# Altium schematic sheet FPGA.SchDoc: Power and decoupling FPGA
size C; DocumentNumber: 4; SheetNumber: 4
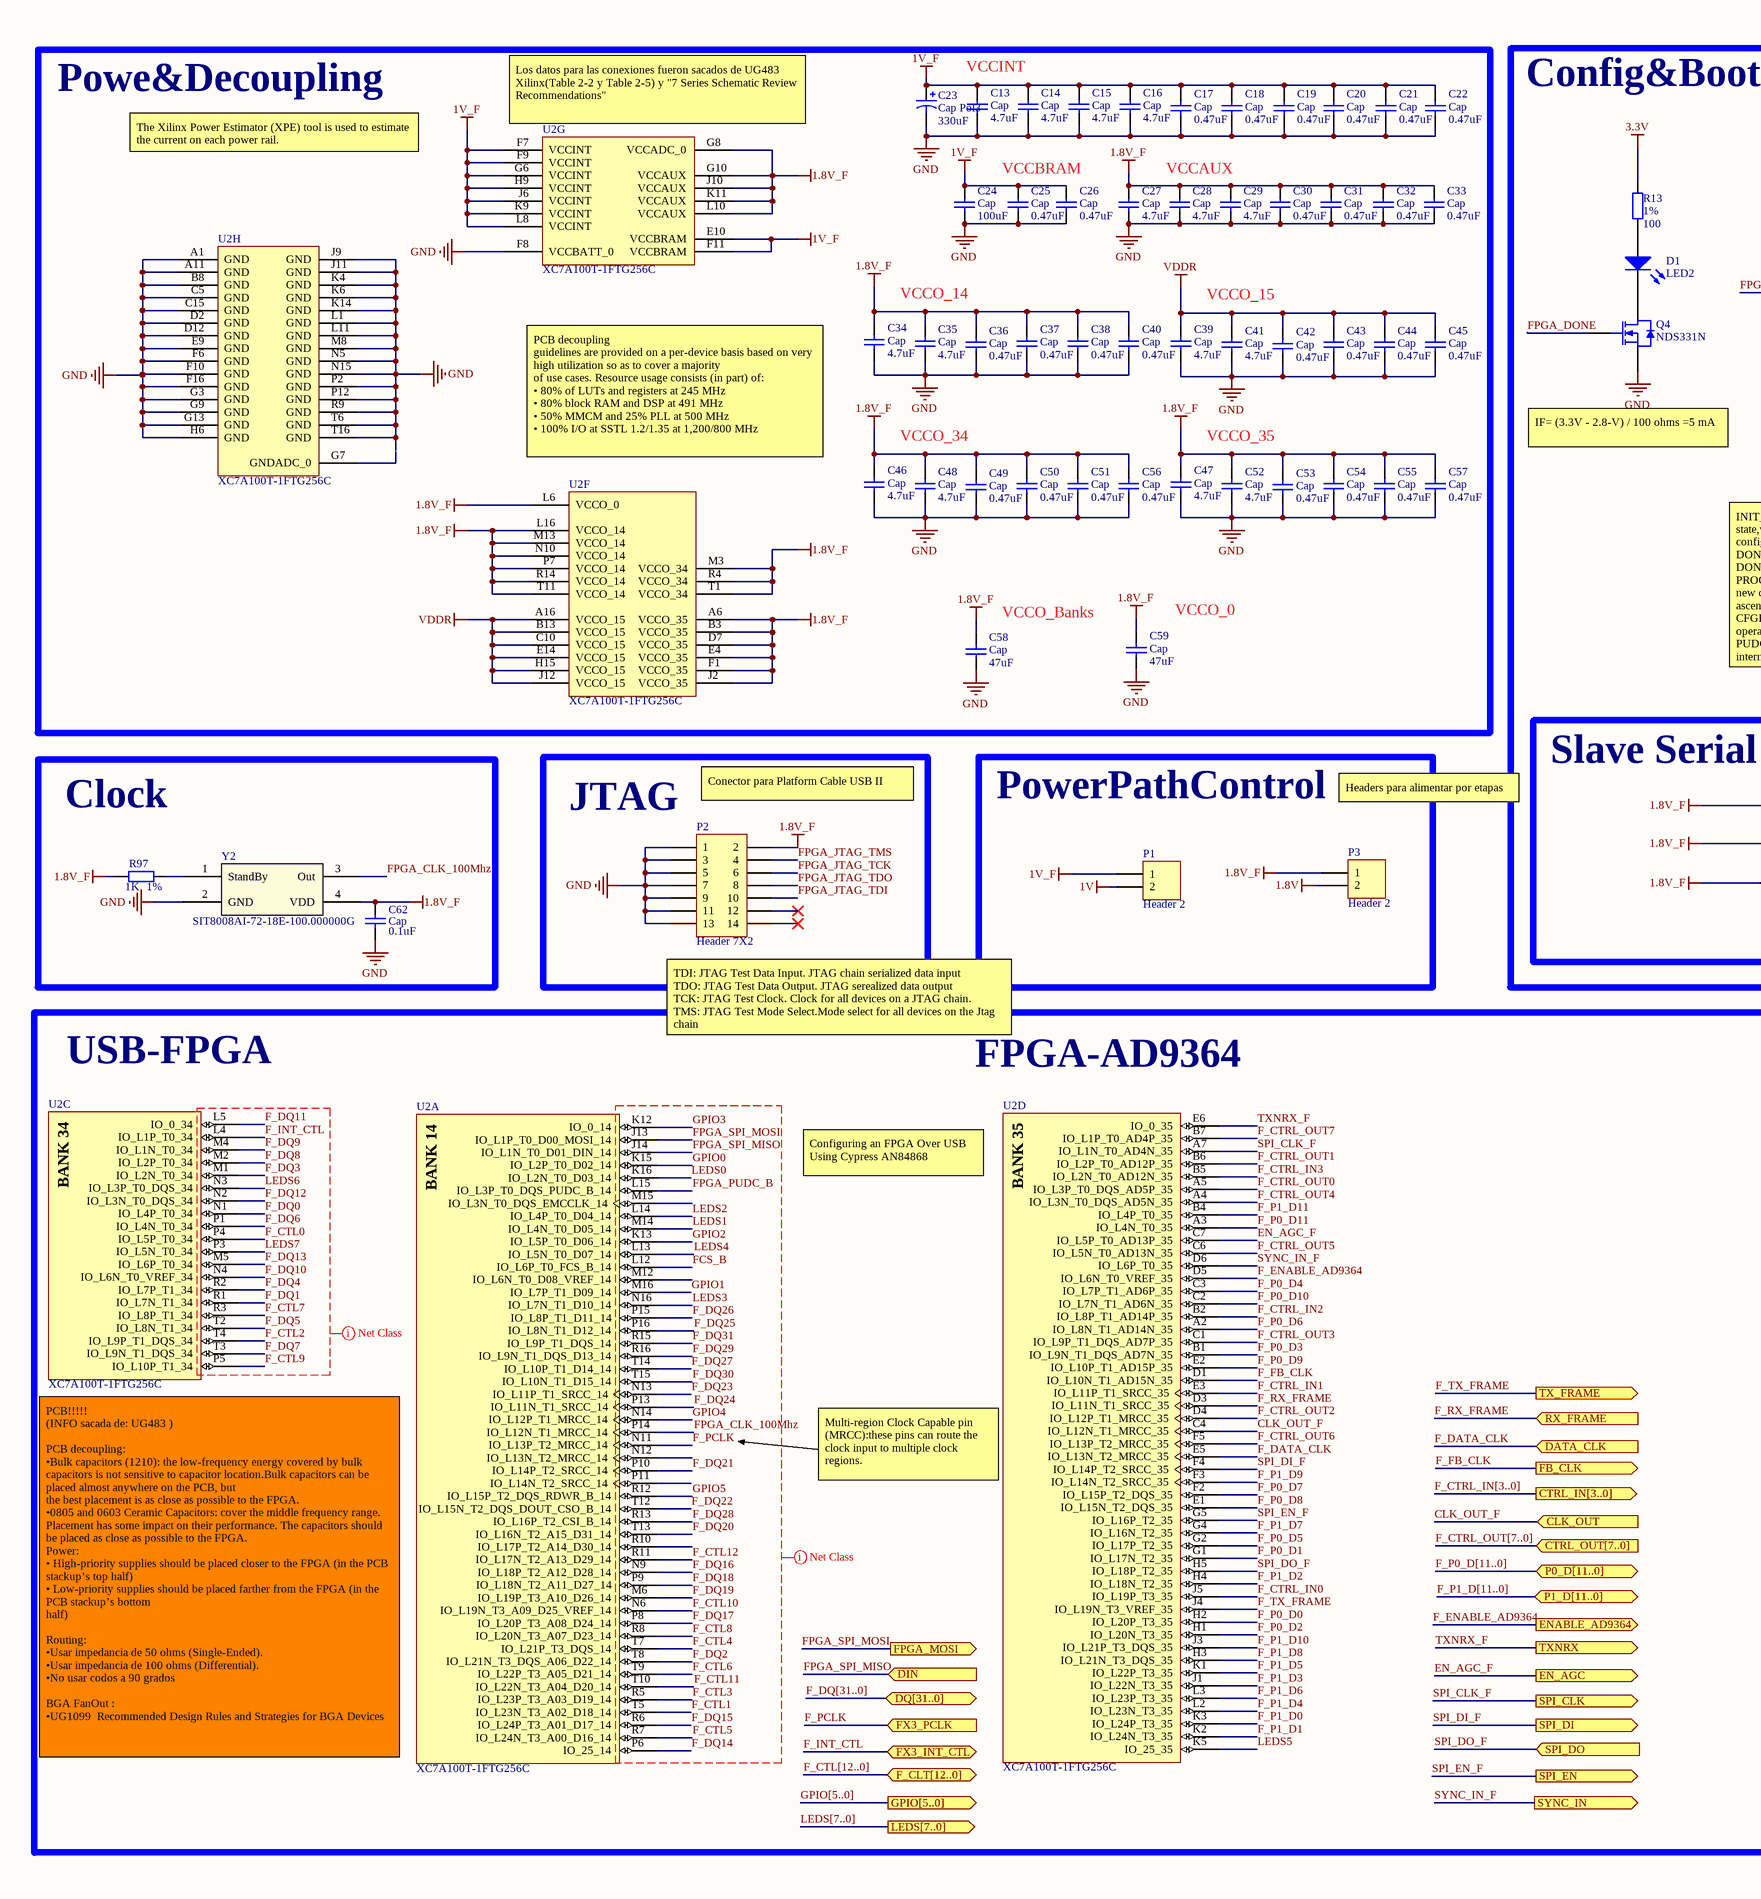
[diagram p0: FPGA.SchDoc, left]
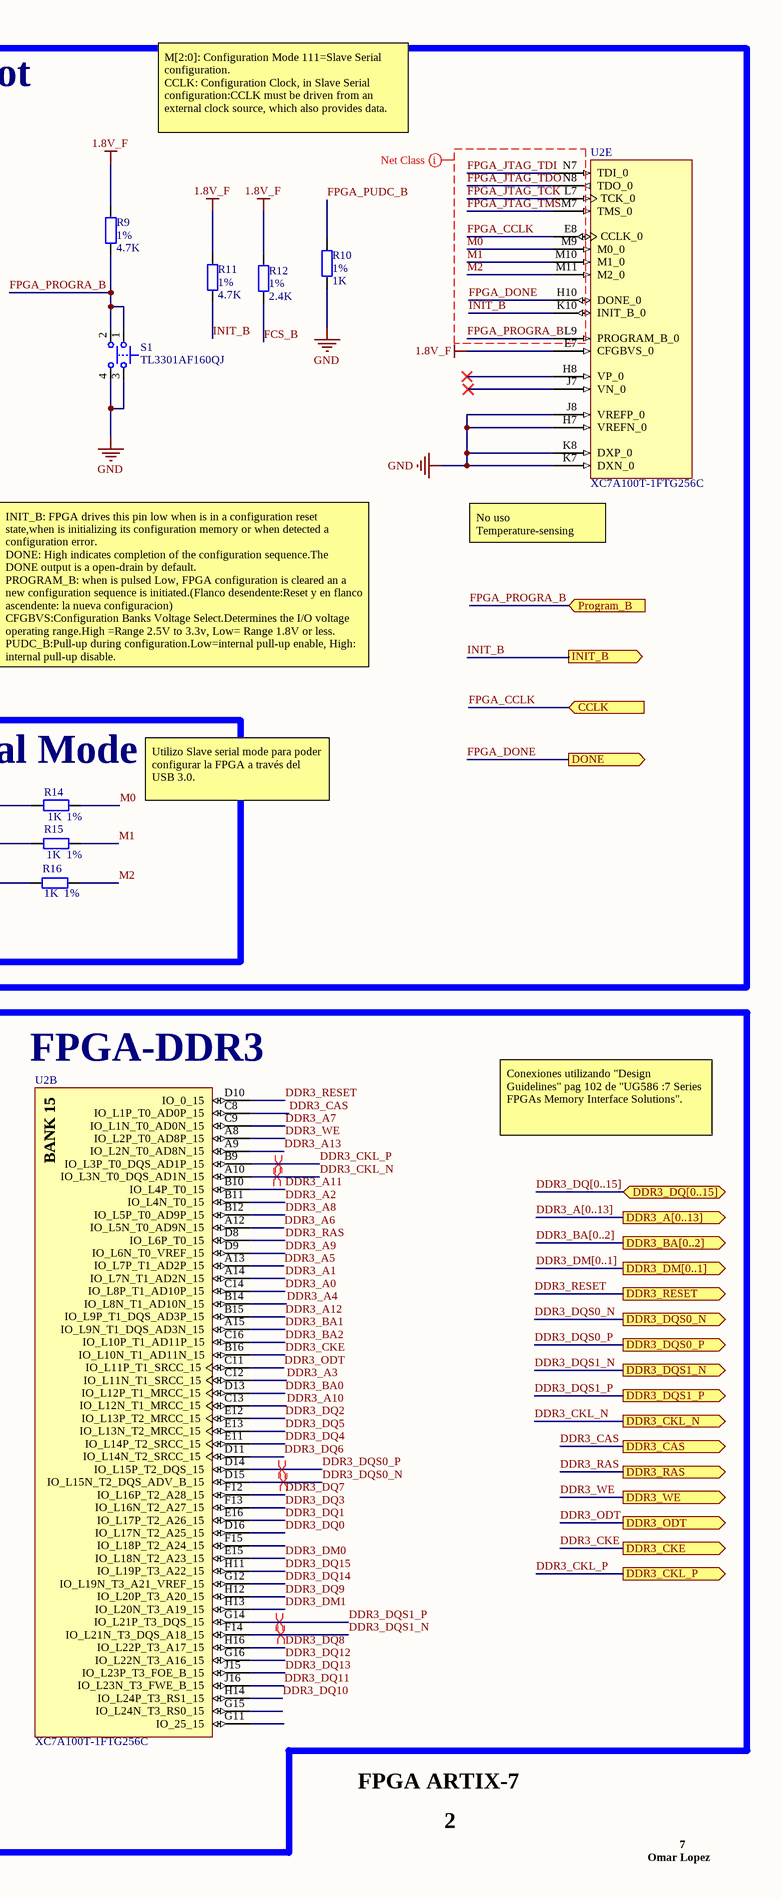
[diagram p1: FPGA.SchDoc, right]

## Parts
C13  Cap  value 4.7uF  [GRM0805MurataCap]
C14  Cap  value 4.7uF  [GRM0805MurataCap]
C15  Cap  value 4.7uF  [GRM0805MurataCap]
C16  Cap  value 4.7uF  [GRM0805MurataCap]
C17  Cap  value 0.47uF  [GRM0603MurataCap]
C18  Cap  value 0.47uF  [GRM0603MurataCap]
C19  Cap  value 0.47uF  [GRM0603MurataCap]
C20  Cap  value 0.47uF  [GRM0603MurataCap]
C21  Cap  value 0.47uF  [GRM0603MurataCap]
C22  Cap  value 0.47uF  [GRM0603MurataCap]
C23  Cap Pol3  value 330uF  [7343]
C24  Cap  value 100uF  [GRM1210MurataCap]
C25  Cap  value 0.47uF  [GRM0603MurataCap]
C26  Cap  value 0.47uF  [GRM0603MurataCap]
C27  Cap  value 4.7uF  [GRM0805MurataCap]
C28  Cap  value 4.7uF  [GRM0805MurataCap]
C29  Cap  value 4.7uF  [GRM0805MurataCap]
C30  Cap  value 0.47uF  [GRM0603MurataCap]
C31  Cap  value 0.47uF  [GRM0603MurataCap]
C32  Cap  value 0.47uF  [GRM0603MurataCap]
C33  Cap  value 0.47uF  [GRM0603MurataCap]
C34  Cap  value 4.7uF  [GRM0805MurataCap]
C35  Cap  value 4.7uF  [GRM0805MurataCap]
C36  Cap  value 0.47uF  [GRM0603MurataCap]
C37  Cap  value 0.47uF  [GRM0603MurataCap]
C38  Cap  value 0.47uF  [GRM0603MurataCap]
C39  Cap  value 4.7uF  [GRM0805MurataCap]
C40  Cap  value 0.47uF  [GRM0603MurataCap]
C41  Cap  value 4.7uF  [GRM0805MurataCap]
C42  Cap  value 0.47uF  [GRM0603MurataCap]
C43  Cap  value 0.47uF  [GRM0603MurataCap]
C44  Cap  value 0.47uF  [GRM0603MurataCap]
C45  Cap  value 0.47uF  [GRM0603MurataCap]
C46  Cap  value 4.7uF  [GRM0805MurataCap]
C47  Cap  value 4.7uF  [GRM0805MurataCap]
C48  Cap  value 4.7uF  [GRM0805MurataCap]
C49  Cap  value 0.47uF  [GRM0603MurataCap]
C50  Cap  value 0.47uF  [GRM0603MurataCap]
C51  Cap  value 0.47uF  [GRM0603MurataCap]
C52  Cap  value 4.7uF  [GRM0805MurataCap]
C53  Cap  value 0.47uF  [GRM0603MurataCap]
C54  Cap  value 0.47uF  [GRM0603MurataCap]
C55  Cap  value 0.47uF  [GRM0603MurataCap]
C56  Cap  value 0.47uF  [GRM0603MurataCap]
C57  Cap  value 0.47uF  [GRM0603MurataCap]
C58  Cap  value 47uF  [GRM1210MurataCap]
C59  Cap  value 47uF  [GRM1210MurataCap]
C62  Cap  value 0.1uF  [GRM0402MurataCap]
D1  LED2  [LTSTC191]
P1  Header 2  [Header2x1]
P2  Header 7X2  [MolexHeader2x7_]
P3  Header 2  [Header2x1]
Q4  NDS331N  [ON_Semi_527AG-01_0]
R9  1%  value 4.7K  [RC0402N]
R10  1%  value 1K  [RC0402N]
R11  1%  value 4.7K  [RC0402N]
R12  1%  value 2.4K  [RC0402N]
R13  1%  value 100  [RC0402N]
R14  1%  value 1K  [RC0402N]
R15  1%  value 1K  [RC0402N]
R16  1%  value 1K  [RC0402N]
R97  1%  value 1K  [RC0402N]
S1  TL3301AF160QJ  [TL3301AF160QJ]
U2  XC7A100T-1FTG256C  [FTG256]  (parts A,B,C,D,E,F,G,H of 8)
Y2  SIT8008AI-72-18E-100.000000G  [SiT2002AI-72-18E-100.000000G]

## Blocks framed on the sheet
Powe&Decoupling: C13-C59 U2
Config&Boot: D1 Q4 R9-R13 S1 U2
JTAG: P2
PowerPathControl: P1 P3
Slave Serial Mode: R14-R16
Clock: C62 R97 Y2

## Ports
CCLK (in), CLK_OUT (in), CTRL_IN[3..0] (out), CTRL_OUT[7..0] (in), DATA_CLK (in), DDR3_A[0..13] (out), DDR3_BA[0..2] (out), DDR3_CAS (out), DDR3_CKE (out), DDR3_CKL_N (out), DDR3_CKL_P (out), DDR3_DM[0..1] (out), DDR3_DQ[0..15] (bidir), DDR3_DQS0_N (out), DDR3_DQS0_P (out), DDR3_DQS1_N (out), DDR3_DQS1_P (out), DDR3_ODT (out), DDR3_RAS (out), DDR3_RESET (out), DDR3_WE (out), DIN (in), DONE (out), DQ[31..0] (bidir), EN_AGC (out), ENABLE_AD9364 (out), F_CLT[12..0] (bidir), FB_CLK (out), FPGA_MOSI (out), FX3_INT_CTL (bidir), FX3_PCLK (in), GPIO[5..0] (out), INIT_B (out), LEDS[7..0] (out), P0_D[11..0] (bidir), P1_D[11..0] (bidir), Program_B (in), RX_FRAME (in), SPI_CLK (out), SPI_DI (out), SPI_DO (in), SPI_EN (out), SYNC_IN (out), TX_FRAME (out), TXNRX (out)

## Nets
1.8V: P3.2
1.8V_F: C27.1 C28.1 C29.1 C30.1 C31.1 C32.1 C33.1 C34.1 C35.1 C36.1 C37.1 C38.1 C40.1 C46.1 C47.1 C48.1 C49.1 C50.1 C51.1 C52.1 C53.1 C54.1 C55.1 C56.1 C57.1 C58.1 C59.1 C62.1 P2.2 P3.1 R9.2 R11.2 R12.2 R14.2 R15.2 R16.2 R97.1 U2.A6(VCCO_35) U2.B3(VCCO_35) U2.D7(VCCO_35) U2.E4(VCCO_35) U2.E7(CFGBVS_0) U2.F1(VCCO_35) U2.G8(VCCADC_0) U2.G10(VCCAUX) U2.J2(VCCO_35) U2.J10(VCCAUX) U2.K11(VCCAUX) U2.L6(VCCO_0) U2.L10(VCCAUX) U2.L16(VCCO_14) U2.M3(VCCO_34) U2.M13(VCCO_14) U2.N10(VCCO_14) U2.P7(VCCO_14) U2.R4(VCCO_34) U2.R14(VCCO_14) U2.T1(VCCO_34) U2.T11(VCCO_14) Y2.4(VDD)
1V: P1.2
1V_F: C13.1 C14.1 C15.1 C16.1 C17.1 C18.1 C19.1 C20.1 C21.1 C22.1 C23.1 C24.1 C25.1 C26.1 P1.1 U2.E10(VCCBRAM) U2.F7(VCCINT) U2.F9(VCCINT) U2.F11(VCCBRAM) U2.G6(VCCINT) U2.H9(VCCINT) U2.J6(VCCINT) U2.K9(VCCINT) U2.L8(VCCINT)
3.3V: R13.2
GND: C13.2 C14.2 C15.2 C16.2 C17.2 C18.2 C19.2 C20.2 C21.2 C22.2 C23.2 C24.2 C25.2 C26.2 C27.2 C28.2 C29.2 C30.2 C31.2 C32.2 C33.2 C34.2 C35.2 C36.2 C37.2 C38.2 C39.2 C40.2 C41.2 C42.2 C43.2 C44.2 C45.2 C46.2 C47.2 C48.2 C49.2 C50.2 C51.2 C52.2 C53.2 C54.2 C55.2 C56.2 C57.2 C58.2 C59.2 C62.2 P2.1 P2.3 P2.5 P2.7 P2.9 P2.11 P2.13 Q4.3(S) R10.2 S1.3 S1.4 U2.A1(GND) U2.A11(GND) U2.B8(GND) U2.C5(GND) U2.C15(GND) U2.D2(GND) U2.D12(GND) U2.E9(GND) U2.F6(GND) U2.F8(VCCBATT_0) U2.F10(GND) U2.F16(GND) U2.G3(GND) U2.G9(GND) U2.G13(GND) U2.H6(GND) U2.H7(VREFN_0) U2.J8(VREFP_0) U2.J9(GND) U2.J11(GND) U2.K4(GND) U2.K6(GND) U2.K7(DXN_0) U2.K8(DXP_0) U2.K14(GND) U2.L1(GND) U2.L11(GND) U2.M8(GND) U2.N5(GND) U2.N15(GND) U2.P2(GND) U2.P12(GND) U2.R9(GND) U2.T6(GND) U2.T16(GND) Y2.2(GND)
VDDR: C39.1 C41.1 C42.1 C43.1 C44.1 C45.1 U2.A16(VCCO_15) U2.B13(VCCO_15) U2.C10(VCCO_15) U2.E14(VCCO_15) U2.H15(VCCO_15) U2.J12(VCCO_15)
CLK_OUT_F: U2.C4(IO_L12N_T1_MRCC_35) ; port CLK_OUT
DDR3_A0: U2.C14(IO_L8P_T1_AD10P_15)
DDR3_A1: U2.A14(IO_L7N_T1_AD2N_15)
DDR3_A2: U2.B11(IO_L4N_T0_15)
DDR3_A3: U2.C12(IO_L11N_T1_SRCC_15)
DDR3_A4: U2.B14(IO_L8N_T1_AD10N_15)
DDR3_A5: U2.A13(IO_L7P_T1_AD2P_15)
DDR3_A6: U2.A12(IO_L5N_T0_AD9N_15)
DDR3_A7: U2.C9(IO_L1N_T0_AD0N_15)
DDR3_A8: U2.B12(IO_L5P_T0_AD9P_15)
DDR3_A9: U2.D9(IO_L6N_T0_VREF_15)
DDR3_A10: U2.C13(IO_L12N_T1_MRCC_15)
DDR3_A11: U2.B10(IO_L4P_T0_15)
DDR3_A12: U2.B15(IO_L9P_T1_DQS_AD3P_15)
DDR3_A13: U2.A9(IO_L2N_T0_AD8N_15)
DDR3_BA0: U2.D13(IO_L12P_T1_MRCC_15)
DDR3_BA1: U2.A15(IO_L9N_T1_DQS_AD3N_15)
DDR3_BA2: U2.C16(IO_L10P_T1_AD11P_15)
DDR3_CAS: U2.C8(IO_L1P_T0_AD0P_15) ; port DDR3_CAS
DDR3_CKE: U2.B16(IO_L10N_T1_AD11N_15) ; port DDR3_CKE
DDR3_CKL_N: U2.A10(IO_L3N_T0_DQS_AD1N_15) ; port DDR3_CKL_N
DDR3_CKL_P: U2.B9(IO_L3P_T0_DQS_AD1P_15) ; port DDR3_CKL_P
DDR3_DM0: U2.E15(IO_L18N_T2_A23_15)
DDR3_DM1: U2.H13(IO_L20N_T3_A19_15)
DDR3_DQ0: U2.D16(IO_L17N_T2_A25_15)
DDR3_DQ1: U2.E16(IO_L17P_T2_A26_15)
DDR3_DQ2: U2.E12(IO_L13P_T2_MRCC_15)
DDR3_DQ3: U2.F13(IO_L16N_T2_A27_15)
DDR3_DQ4: U2.E11(IO_L14P_T2_SRCC_15)
DDR3_DQ5: U2.E13(IO_L13N_T2_MRCC_15)
DDR3_DQ6: U2.D11(IO_L14N_T2_SRCC_15)
DDR3_DQ7: U2.F12(IO_L16P_T2_A28_15)
DDR3_DQ8: U2.H16(IO_L22P_T3_A17_15)
DDR3_DQ9: U2.H12(IO_L20P_T3_A20_15)
DDR3_DQ10: U2.H14(IO_L24P_T3_RS1_15)
DDR3_DQ11: U2.J16(IO_L23N_T3_FWE_B_15)
DDR3_DQ12: U2.G16(IO_L22N_T3_A16_15)
DDR3_DQ13: U2.J15(IO_L23P_T3_FOE_B_15)
DDR3_DQ14: U2.G12(IO_L19N_T3_A21_VREF_15)
DDR3_DQ15: U2.H11(IO_L19P_T3_A22_15)
DDR3_DQS0_N: U2.D15(IO_L15N_T2_DQS_ADV_B_15) ; port DDR3_DQS0_N
DDR3_DQS0_P: U2.D14(IO_L15P_T2_DQS_15) ; port DDR3_DQS0_P
DDR3_DQS1_N: U2.F14(IO_L21N_T3_DQS_A18_15) ; port DDR3_DQS1_N
DDR3_DQS1_P: U2.G14(IO_L21P_T3_DQS_15) ; port DDR3_DQS1_P
DDR3_ODT: U2.C11(IO_L11P_T1_SRCC_15) ; port DDR3_ODT
DDR3_RAS: U2.D8(IO_L6P_T0_15) ; port DDR3_RAS
DDR3_RESET: U2.D10(IO_0_15) ; port DDR3_RESET
DDR3_WE: U2.A8(IO_L2P_T0_AD8P_15) ; port DDR3_WE
EN_AGC_F: U2.C7(IO_L5P_T0_AD13P_35) ; port EN_AGC
F_CTL0: U2.P4(IO_L5P_T0_34)
F_CTL1: U2.T5(IO_L23N_T3_A02_D18_14)
F_CTL2: U2.T4(IO_L9P_T1_DQS_34)
F_CTL3: U2.R5(IO_L23P_T3_A03_D19_14)
F_CTL4: U2.T7(IO_L21P_T3_DQS_14)
F_CTL5: U2.R7(IO_L24N_T3_A00_D16_14)
F_CTL6: U2.T9(IO_L22P_T3_A05_D21_14)
F_CTL7: U2.R3(IO_L8P_T1_34)
F_CTL8: U2.R8(IO_L20N_T3_A07_D23_14)
F_CTL9: U2.P5(IO_L10P_T1_34)
F_CTL10: U2.N6(IO_L19N_T3_A09_D25_VREF_14)
F_CTL11: U2.T10(IO_L22N_T3_A04_D20_14)
F_CTL12: U2.R11(IO_L17N_T2_A13_D29_14)
F_CTRL_IN0: U2.J5(IO_L19P_T3_35)
F_CTRL_IN1: U2.E3(IO_L11P_T1_SRCC_35)
F_CTRL_IN2: U2.B2(IO_L8P_T1_AD14P_35)
F_CTRL_IN3: U2.B5(IO_L2N_T0_AD12N_35)
F_CTRL_OUT0: U2.A5(IO_L3P_T0_DQS_AD5P_35)
F_CTRL_OUT1: U2.B6(IO_L2P_T0_AD12P_35)
F_CTRL_OUT2: U2.D4(IO_L12P_T1_MRCC_35)
F_CTRL_OUT3: U2.C1(IO_L9P_T1_DQS_AD7P_35)
F_CTRL_OUT4: U2.A4(IO_L3N_T0_DQS_AD5N_35)
F_CTRL_OUT5: U2.C6(IO_L5N_T0_AD13N_35)
F_CTRL_OUT6: U2.F5(IO_L13P_T2_MRCC_35)
F_CTRL_OUT7: U2.B7(IO_L1P_T0_AD4P_35)
F_DATA_CLK: U2.E5(IO_L13N_T2_MRCC_35) ; port DATA_CLK
F_DQ0: U2.N1(IO_L4P_T0_34)
F_DQ1: U2.R1(IO_L7N_T1_34)
F_DQ2: U2.T8(IO_L21N_T3_DQS_A06_D22_14)
F_DQ3: U2.M1(IO_L2N_T0_34)
F_DQ4: U2.R2(IO_L7P_T1_34)
F_DQ5: U2.T2(IO_L8N_T1_34)
F_DQ6: U2.P1(IO_L4N_T0_34)
F_DQ7: U2.T3(IO_L9N_T1_DQS_34)
F_DQ8: U2.M2(IO_L2P_T0_34)
F_DQ9: U2.M4(IO_L1N_T0_34)
F_DQ10: U2.N4(IO_L6N_T0_VREF_34)
F_DQ11: U2.L5(IO_0_34)
F_DQ12: U2.N2(IO_L3N_T0_DQS_34)
F_DQ13: U2.M5(IO_L6P_T0_34)
F_DQ14: U2.P6(IO_25_14)
F_DQ15: U2.R6(IO_L24P_T3_A01_D17_14)
F_DQ16: U2.N9(IO_L18P_T2_A12_D28_14)
F_DQ17: U2.P8(IO_L20P_T3_A08_D24_14)
F_DQ18: U2.P9(IO_L18N_T2_A11_D27_14)
F_DQ19: U2.M6(IO_L19P_T3_A10_D26_14)
F_DQ20: U2.T13(IO_L16N_T2_A15_D31_14)
F_DQ21: U2.P10(IO_L14P_T2_SRCC_14)
F_DQ22: U2.T12(IO_L15N_T2_DQS_DOUT_CSO_B_14)
F_DQ23: U2.N13(IO_L11P_T1_SRCC_14)
F_DQ24: U2.P13(IO_L11N_T1_SRCC_14)
F_DQ25: U2.P16(IO_L8N_T1_D12_14)
F_DQ26: U2.P15(IO_L8P_T1_D11_14)
F_DQ27: U2.T14(IO_L10P_T1_D14_14)
F_DQ28: U2.R13(IO_L16P_T2_CSI_B_14)
F_DQ29: U2.R16(IO_L9N_T1_DQS_D13_14)
F_DQ30: U2.T15(IO_L10N_T1_D15_14)
F_DQ31: U2.R15(IO_L9P_T1_DQS_14)
F_ENABLE_AD9364: U2.D5(IO_L6N_T0_VREF_35) ; port ENABLE_AD9364
F_FB_CLK: U2.D1(IO_L10N_T1_AD15N_35) ; port FB_CLK
F_INT_CTL: U2.L4(IO_L1P_T0_34) ; port FX3_INT_CTL
F_P0_D0: U2.H2(IO_L20P_T3_35)
F_P0_D1: U2.G1(IO_L17N_T2_35)
F_P0_D2: U2.H1(IO_L20N_T3_35)
F_P0_D3: U2.B1(IO_L9N_T1_DQS_AD7N_35)
F_P0_D4: U2.C3(IO_L7P_T1_AD6P_35)
F_P0_D5: U2.G2(IO_L17P_T2_35)
F_P0_D6: U2.A2(IO_L8N_T1_AD14N_35)
F_P0_D7: U2.F2(IO_L15P_T2_DQS_35)
F_P0_D8: U2.E1(IO_L15N_T2_DQS_35)
F_P0_D9: U2.E2(IO_L10P_T1_AD15P_35)
F_P0_D10: U2.C2(IO_L7N_T1_AD6N_35)
F_P0_D11: U2.A3(IO_L4N_T0_35)
F_P1_D0: U2.K3(IO_L24P_T3_35)
F_P1_D1: U2.K2(IO_L24N_T3_35)
F_P1_D2: U2.H4(IO_L18N_T2_35)
F_P1_D3: U2.J1(IO_L22N_T3_35)
F_P1_D4: U2.L2(IO_L23N_T3_35)
F_P1_D5: U2.K1(IO_L22P_T3_35)
F_P1_D6: U2.L3(IO_L23P_T3_35)
F_P1_D7: U2.G4(IO_L16N_T2_35)
F_P1_D8: U2.H3(IO_L21N_T3_DQS_35)
F_P1_D9: U2.F3(IO_L14N_T2_SRCC_35)
F_P1_D10: U2.J3(IO_L21P_T3_DQS_35)
F_P1_D11: U2.B4(IO_L4P_T0_35)
F_PCLK: U2.N11(IO_L13P_T2_MRCC_14) ; port FX3_PCLK
F_RX_FRAME: U2.D3(IO_L11N_T1_SRCC_35) ; port RX_FRAME
F_TX_FRAME: U2.J4(IO_L19N_T3_VREF_35) ; port TX_FRAME
FCS_B: R12.1 U2.L12(IO_L6P_T0_FCS_B_14)
FPGA_CCLK: U2.E8(CCLK_0) ; port CCLK
FPGA_CLK_100Mhz: U2.P14(IO_L12N_T1_MRCC_14) Y2.3(Out)
FPGA_DONE: Q4.1(G) U2.H10(DONE_0) ; port DONE
FPGA_JTAG_TCK: P2.6 U2.L7(TCK_0)
FPGA_JTAG_TDI: P2.10 U2.N7(TDI_0)
FPGA_JTAG_TDO: P2.8 U2.N8(TDO_0)
FPGA_JTAG_TMS: P2.4 U2.M7(TMS_0)
FPGA_PROGRA_B: R9.1 S1.1 S1.2 U2.L9(PROGRAM_B_0) ; port Program_B
FPGA_PUDC_B: R10.1 U2.L15(IO_L3P_T0_DQS_PUDC_B_14)
FPGA_SPI_MISO: U2.J14(IO_L1N_T0_D01_DIN_14) ; port DIN
FPGA_SPI_MOSI: U2.J13(IO_L1P_T0_D00_MOSI_14) ; port FPGA_MOSI
GPIO0: U2.K15(IO_L2P_T0_D02_14)
GPIO1: U2.M16(IO_L7P_T1_D09_14)
GPIO2: U2.K13(IO_L5P_T0_D06_14)
GPIO3: U2.K12(IO_0_14)
GPIO4: U2.N14(IO_L12P_T1_MRCC_14)
GPIO5: U2.R12(IO_L15P_T2_DQS_RDWR_B_14)
INIT_B: R11.1 U2.K10(INIT_B_0) ; port INIT_B
LEDS0: U2.K16(IO_L2N_T0_D03_14)
LEDS1: U2.M14(IO_L4N_T0_D05_14)
LEDS2: U2.L14(IO_L4P_T0_D04_14)
LEDS3: U2.N16(IO_L7N_T1_D10_14)
LEDS4: U2.L13(IO_L5N_T0_D07_14)
LEDS5: U2.K5(IO_25_35)
LEDS6: U2.N3(IO_L3P_T0_DQS_34)
LEDS7: U2.P3(IO_L5N_T0_34)
M0: R14.1 U2.M9(M0_0)
M1: R15.1 U2.M10(M1_0)
M2: R16.1 U2.M11(M2_0)
SPI_CLK_F: U2.A7(IO_L1N_T0_AD4N_35) ; port SPI_CLK
SPI_DI_F: U2.F4(IO_L14P_T2_SRCC_35) ; port SPI_DI
SPI_DO_F: U2.H5(IO_L18P_T2_35) ; port SPI_DO
SPI_EN_F: U2.G5(IO_L16P_T2_35) ; port SPI_EN
SYNC_IN_F: U2.D6(IO_L6P_T0_35) ; port SYNC_IN
TXNRX_F: U2.E6(IO_0_35) ; port TXNRX
NetD1_1: D1.1(A) R13.1
NetD1_2: D1.2(K) Q4.2(D)
NetR97_2: R97.2 Y2.1(StandBy)

Not connected (* = marked no-connect by the designer): P2 12* 14*; U2 F15(IO_L18P_T2_A24_15) G7(GNDADC_0) G11(IO_25_15) G15(IO_L24N_T3_RS0_15) H8(VP_0)* J7(VN_0)* M12(IO_L6N_T0_D08_VREF_14) M15(IO_L3N_T0_DQS_EMCCLK_14) N12(IO_L13N_T2_MRCC_14) P11(IO_L14N_T2_SRCC_14) R10(IO_L17P_T2_A14_D30_14)

## Buses and harness runs
bus DDR3_A[0..13] = port DDR3_A[0..13]
bus DDR3_BA[0..2] = port DDR3_BA[0..2]
bus DDR3_DM[0..1] = port DDR3_DM[0..1]
bus DDR3_DQ[0..15] = port DDR3_DQ[0..15]
bus F_CTL[12..0] = port F_CLT[12..0]
bus F_CTRL_IN[3..0] = port CTRL_IN[3..0]
bus F_CTRL_OUT[7..0] = port CTRL_OUT[7..0]
bus F_DQ[31..0] = port DQ[31..0]
bus F_P0_D[11..0] = port P0_D[11..0]
bus F_P1_D[11..0] = port P1_D[11..0]
bus GPIO[5..0] = port GPIO[5..0]
bus LEDS[7..0] = port LEDS[7..0]

## Layout directives
differential pair; net class DDR3_Diff100: DDR3_CKL_N, DDR3_CKL_P, DDR3_DQS0_N, DDR3_DQS0_P, DDR3_DQS1_N, DDR3_DQS1_P
net class FPGA_Signals: F_CTL0, F_CTL1, F_CTL2, F_CTL3, F_CTL4, F_CTL5, F_CTL6, F_CTL7, F_CTL8, F_CTL9, F_CTL10, F_CTL11, F_CTL12, F_DQ0, F_DQ1, F_DQ2, F_DQ3, F_DQ4, F_DQ5, F_DQ6, F_DQ7, F_DQ8, F_DQ9, F_DQ10, F_DQ11, F_DQ12, F_DQ13, F_DQ14, F_DQ15, F_DQ16, F_DQ17, F_DQ18, F_DQ19, F_DQ20, F_DQ21, F_DQ22, F_DQ23, F_DQ24, F_DQ25, F_DQ26, F_DQ27, F_DQ28, F_DQ29, F_DQ30, F_DQ31, F_INT_CTL, F_PCLK, FCS_B, FPGA_CCLK, FPGA_CLK_100Mhz, FPGA_DONE, FPGA_JTAG_TCK, FPGA_JTAG_TDI, FPGA_JTAG_TDO, FPGA_JTAG_TMS, FPGA_PROGRA_B, FPGA_PUDC_B, FPGA_SPI_MISO, FPGA_SPI_MOSI, GPIO0, GPIO1, GPIO2, GPIO3, GPIO4, GPIO5, INIT_B, LEDS0, LEDS1, LEDS2, LEDS3, LEDS4, LEDS6, LEDS7, M0, M1, M2

## Notes on the sheet
- VCCINT
- The Xilinx Power Estimator (XPE) tool is used to estimate the current on each power rail.
- (near U2) Los datos para las conexiones fueron sacados de UG483 Xilinx(Table 2-2 y Table 2-5) y "7 Series Schematic Review Recommendations"
- M[2:0]: Configuration Mode 111=Slave Serial configuration.
  CCLK: Configuration Clock, in Slave Serial configuration:CCLK must be driven from an external clock source, which also provides data.
- VCCBRAM
- VCCAUX
- VCCO_14
- VCCO_15
- PCB decoupling
  guidelines are provided on a per-device basis based on very high utilization so as to cover a majority
  of use cases. Resource usage consists (in part) of:
  • 80% of LUTs and registers at 245 MHz
  • 80% block RAM and DSP at 491 MHz
  • 50% MMCM and 25% PLL at 500 MHz
  • 100% I/O at SSTL 1.2/1.35 at 1,200/800 MHz
- VCCO_34
- VCCO_35
- IF= (3.3V - 2.8-V) / 100 ohms =5 mA
- (near U2) No uso Temperature-sensing diode(Pag. 27 UG475)
- VCCO_Banks
- (near C59) VCCO_0
- INIT_B: FPGA drives this pin low when is in a configuration reset state,when is initializing its configuration memory or when detected a configuration error.
  DONE: High indicates completion of the configuration sequence.The DONE output is a open-drain by default.
  PROGRAM_B: when is pulsed Low, FPGA configuration is cleared an a new configuration sequence is initiated.(Flanco desendente:Reset y en flanco ascendente: la nueva configuracion)
  CFGBVS:Configuration Banks Voltage Select.Determines the I/O voltage operating range.High =Range 2.5V to 3.3v, Low= Range 1.8V or less.
  PUDC_B:Pull-up during configuration.Low=internal pull-up enable, High: internal pull-up disable.
- (near P2) Conector para Platform Cable USB II
- Headers para alimentar por etapas
- Utilizo Slave serial mode para poder configurar la FPGA a través del USB 3.0.
- (near P2) TDI: JTAG Test Data Input. JTAG chain serialized data input
  TDO: JTAG Test Data Output. JTAG serealized data output
  TCK: JTAG Test Clock. Clock for all devices on a JTAG chain.
  TMS: JTAG Test Mode Select.Mode select for all devices on the Jtag chain
- USB-FPGA
- (near U2) FPGA-AD9364
- (near U2) FPGA-DDR3
- Conexiones utilizando "Design Guidelines" pag 102 de "UG586 :7 Series FPGAs Memory Interface Solutions".
- Configuring an FPGA Over USB Using Cypress AN84868
- Multi-region Clock Capable pin (MRCC):these pins can route the clock input to multiple clock regions.
- (near U2) PCB!!!!!
  (INFO sacada de: UG483 )
  PCB decoupling:
  •Bulk capacitors (1210): the low-frequency energy covered by bulk capacitors is not sensitive to capacitor location.Bulk capacitors can be placed almost anywhere on the PCB, but
  the best placement is as close as possible to the FPGA.
  •0805 and 0603 Ceramic Capacitors: cover the middle frequency range. Placement has some impact on their performance. The capacitors should be placed as close as possible to the FPGA.
  Power:
  • High-priority supplies should be placed closer to the FPGA (in the PCB stackup’s top half)
  • Low-priority supplies should be placed farther from the FPGA (in the PCB stackup’s bottom
  half)
  Routing:
  •Usar impedancia de 50 ohms (Single-Ended).
  •Usar impedancia de 100 ohms (Differential).
  •No usar codos a 90 grados
  BGA FanOut :
  •UG1099  Recommended Design Rules and Strategies for BGA Devices
- FPGA ARTIX-7
- 2
- Omar Lopez
- 7
- (in symbol XC7A35T-1FTG256C, part A) BANK 14
- (in symbol XC7A35T-1FTG256C, part B) BANK 15
- (in symbol XC7A35T-1FTG256C, part C) BANK 34
- (in symbol XC7A35T-1FTG256C, part D) BANK 35

## Library data of the parts
C13-C16 C27-C29 C34 C35 C39 C41 C46-C48 C52 = Cap: Capacitor; Manufacturer: Murata; PartNumber: GRM21BR71A475ME51L; Tolerance: 10%; Descripción: Capacitores cerámicos de capas múltiples (MLCC) - SMD/SMT 4.7uF 10Volts 10%; CostoVendedor1: 0.15; Vendedor1: Mouser; Vendedor2: Digi-Key; Package: 0805; DataSheet: http://www.mouser.com/ds/2/281/c02e-2905.pdf; LinkVendedor1: https://ar.mouser.com/ProductDetail/Murata-Electronics/GRM21BR71A475ME51L?qs=sGAEpiMZZMs0AnBnWHyRQKFZIQ7b73cdOJ%252b18hu3nHNP7ecP2aBn8Q%3d%3d; Stock1: 2000
C17-C22 C25 C26 C30-C33 C36-C38 C40 C42-C45 C49-C51 C53-C57 = Cap: Capacitor; Manufacturer: Murata; PartNumber: GRM188R70J474KA01D; Tolerance: 20%; Descripción: Capacitores cerámicos de capas múltiples (MLCC) - SMD/SMT 0.47uF 6.3Volts X7R 10%; CostoVendedor1: 0.13; CostoVendedor2: 0.15; Vendedor1: Mouser; Vendedor2: Digi-Key; Package: 0603; DataSheet: http://www.mouser.com/ds/2/281/c02e-2905.pdf; LinkVendedor1: https://ar.mouser.com/ProductDetail/Murata-Electronics/GRM188R70J474KA01D?qs=%2fha2pyFadujAJDtX6qcn4IEoSkts6JpGXPBvg2rvHjOMrE7MDNb4YN4dtl4JIj3Dhttps://ar.mouser.com/ProductDetail/Murata-Electronics/GRM188R70J474KA01D?qs=%2fha2pyFadujAJDtX6qcn4IEoSkts6JpGXPBvg2rvHjOMrE7MDNb4YN4dtl4JIj3D; LinkVendedor2: https://www.digikey.com/product-detail/en/murata-electronics-north-america/GRM188R70J474KA01D/490-6416-1-ND/3845613; Stock1: 50000; Stock2: 22000
C23 = Cap Pol3: Polarized Capacitor (Surface Mount); PartNumber: T520V337M2R5ATE025; Manufacturer: KEMET; Tolerance: 20%; Descripción: Capacitores de tantalio - SMD de polímero 330uF 2.5V ESR=25; CostoVendedor1: 3.7; Vendedor1: Mouser; Vendedor2: Digi-Key; Package: 2917; DataSheet: http://www.mouser.com/ds/2/212/Datasheet-T520V337M2R5ATE025-1079218.pdf; LinkVendedor1: https://ar.mouser.com/ProductDetail/KEMET/T520V337M2R5ATE025?qs=sGAEpiMZZMtZ1n0r9vR22YwJteCdQAdahWeFkhHH95Y%3d; Stock1: 144
C24 = Cap: Capacitor; Manufacturer: Murata; PartNumber: GRM32EC80G107KE20L; Tolerance: 20%; Descripción: Capacitores cerámicos de capas múltiples (MLCC) - SMD/SMT 1210 100uF 6.3volts X5R 20%; CostoVendedor1: 0.83; CostoVendedor2: 0.94; Vendedor1: Mouser; Vendedor2: Digi-Key; Package: 1210; DataSheet: http://www.mouser.com/ds/2/281/c02e-2905.pdf; LinkVendedor1: https://ar.mouser.com/ProductDetail/Murata-Electronics/GRM32EC80G107KE20L?qs=sGAEpiMZZMs0AnBnWHyRQKFZIQ7b73cd%252b4EnaztCUZC3NhM6Uixm%252bA%3d%3d; LinkVendedor2: https://www.digikey.com/product-detail/en/murata-electronics-north-america/GRM32EC80G107KE20L/490-13984-1-ND/6155814; Stock1: 156; Stock2: 722
C58 C59 = Cap: Capacitor; Manufacturer: Murata; PartNumber: GCJ32ER70J476KE01L; Tolerance: 10%; Descripción: Capacitores cerámicos de capas múltiples (MLCC) - SMD/SMT 1210 47uF 6.3volts X7R 10% Soft Term; CostoVendedor1: 1.28; CostoVendedor2: 1.4; Vendedor1: Mouser; Vendedor2: Digi-Key; Package: 1210; DataSheet: http://www.mouser.com/ds/2/281/c02e-2905.pdf; LinkVendedor1: https://ar.mouser.com/ProductDetail/Murata-Electronics/GCJ32ER70J476KE01L?qs=sGAEpiMZZMs0AnBnWHyRQCYr6WlISeMTo3uC5Zdgk5K0whXMz17svw%3d%3d; LinkVendedor2: https://www.digikey.com/product-detail/en/murata-electronics-north-america/GCJ32ER70J476KE01L/490-10559-1-ND/5030050; Stock1: 25000; Stock2: 1800
C62 = Cap: Capacitor; Manufacturer: Murata; PartNumber: GRM152D70G104ME15D; Descripción: CAP CER 0.1UF 6.3V X6S 0402; Tolerance: 10%; CostoVendedor1: 0.125; CostoVendedor2: 0.2; Vendedor1: Mouser; Vendedor2: Digi-Key; DataSheet: http://www.mouser.com/ds/2/281/c02e-2905.pdf; Package: 0402; LinkVendedor1: https://ar.mouser.com/ProductDetail/Murata-Electronics/GRM152C80J104ME19D?qs=%2fha2pyFadujYxtMOKJb%252bG4KaC8v3hU%2fa667jg855F5IKGi0T5%2fOAAoZ7C20qYSvJ; LinkVendedor2: https://www.digikey.com/product-detail/en/murata-electronics-north-america/GRM152C80J104ME19D/490-9998-1-ND/5026323; Stock1: 17400; Stock2: 15000
D1 = LED2: Typical RED, GREEN, YELLOW, AMBER GaAs LED; Manufacturer: Panasonic; PartNumber: LTST-C193TGKT-5A; Descripción: LED estándar - SMD (montaje superficial) LED RED RECT; CostoVendedor1: 0.28; Vendedor1: Mouser; Vendedor2: Digi-Key; DataSheet: http://www.mouser.com/ds/2/315/LNJ247W82RA_E-947457.pdf; Package: 0603; LinkVendedor1: https://ar.mouser.com/ProductDetail/Lite-On/LTST-C193TGKT-5A?qs=sGAEpiMZZMseGfSY3csMkTQVMbQ3YFstHskAr8LAtWI%3d; Stock1: 29700
P1 P3 = Header 2: Header, 2-Pin; Manufacturer: TE Connectivity; PartNumber: 826629; Descripción: Header 2x1 step 2,54mm; CostoVendedor1: 0.18; Vendedor1: Mouser; Vendedor2: Digi-Key; DataSheet: https://ar.mouser.com/datasheet/2/418/NG_CD_826629_AC-673634.pdf; LinkVendedor1: https://ar.mouser.com/ProductDetail/TE-Connectivity-AMP/5-826629-0?qs=sGAEpiMZZMuSK2mCDyT9clxPLHEBGojU; Stock1: 3600
P2 = Header 7X2: Header, 7-Pin, Dual row; Manufacturer: Molex; PartNumber: 87832-1420; Descripción: Alojamientos de cables y cabecera 14P SMD PB FREE SHRD; CostoVendedor1: 1.75; CostoVendedor2: 1.74; Vendedor1: Mouser; Vendedor2: Digi-Key; DataSheet: https://ar.mouser.com/datasheet/2/276/0878321420_PCB_HEADERS-176595.pdf; LinkVendedor1: https://ar.mouser.com/ProductDetail/Molex/87832-1420?qs=%2fha2pyFaduiiexCbvhC%252bV5aCpyqD3SQm%252bESSuZw9dWA%3d; LinkVendedor2: https://www.digikey.com/products/en?keywords=87832-1420; Stock1: 4000; Stock2: 11000
Q4 = SUP70N06-14: N-Channel 60V (D-S), 175'C  MOSFET; Manufacturer: On Semiconductor; Descripción: MOSFET N-Ch Digital; CostoVendedor1: 0.35; CostoVendedor2: 0.44; Vendedor1: Mouser; Vendedor2: Digi-Key; DataSheet: https://ar.mouser.com/datasheet/2/308/NDS331N-1125222.pdf; Package: SOT23; PartNumber: NDS331N; LinkVendedor1: https://ar.mouser.com/ProductDetail/ON-Semiconductor-Fairchild/NDS331N?qs=%2Fha2pyFaduhqNlXqKbr%252BjEIU%252BqNoYpa937WlNrMOk8Sienkx2gIkoQ%3D%3D&utm_source=octopart&utm_medium=aggregator&utm_campaign=512-NDS331N&utm_content=ON%20Semiconductor; LinkVendedor2: https://www.digikey.com/product-detail/es/NDS331N/NDS331NCT-ND/458997?utm_campaign=buynow&WT.z_cid=ref_octopart_dkc_buynow&utm_medium=aggregator&curr=usd&site=us&utm_source=octopart; Stock1: 340000; Stock2: 135000
R9 R11 R13 = Res2: Resistor; Manufacturer: Panasonic; PartNumber: ERJ-2RKF4701X; Descripción: Anti-Sulfur  100 mW 50V; CostoVendedor1: 0.021; Vendedor1: Mouser; Vendedor2: Digi-Key; Package: 0402; Tolerance: 1%; DataSheet: http://www.mouser.com/ds/2/315/AOA0000C104-947597.pdf
  R9 R11: LinkVendedor1: https://ar.mouser.com/ProductDetail/Panasonic-Industrial-Devices/ERJ-2RKF4701X?qs=%2fha2pyFadujciewGcSbxYIkTCauosbmB2F%2fm6dHWw44IVO0GVwVVXQ%3d%3d; Stock1: 500000
  R13: LinkVendedor1: https://ar.mouser.com/ProductDetail/Panasonic-Industrial-Devices/ERJ-2RKF1000X?qs=sGAEpiMZZMu61qfTUdNhGzxKJJelZRhEGST%2fbP4fbIc%3d; Stock1: 1000000
R10 R14-R16 R97 = Res2: Resistor; Manufacturer: Panasonic; PartNumber: ERJ-PA2F1001X; Descripción: 100mW 50V; CostoVendedor1: 0.097; CostoVendedor2: 0.2; Vendedor1: Mouser; Vendedor2: Digi-Key; Tolerance: 1%; DataSheet: http://www.mouser.com/ds/2/315/AOA0000C86-911473.pdf; LinkVendedor1: https://ar.mouser.com/ProductDetail/Panasonic/ERJ-PA2F1001X?qs=sGAEpiMZZMu61qfTUdNhG9WWcB%2fmnlDsZmBgbIMiP2w2FdBdgtNwNA%3d%3d; LinkVendedor2: https://www.digikey.com/product-detail/en/panasonic-electronic-components/ERJ-PA2F1001X/P17224CT-ND/5402712; Stock1: 4000; Stock2: 27000
R12 = Res2: Resistor; Manufacturer: Panasonic; PartNumber: ERJ-2RKF2401X; Descripción: Anti-Sulfur  100 mW 50V; CostoVendedor1: 0.021; Vendedor1: Mouser; Vendedor2: Digi-Key; Package: 0402; Tolerance: 1%; DataSheet: http://www.mouser.com/ds/2/315/AOA0000C104-947597.pdf; LinkVendedor1: https://ar.mouser.com/ProductDetail/Panasonic-Industrial-Devices/ERJ-2RKF2401X?qs=%2fha2pyFadujciewGcSbxYAB7mdyBrP%252b4VkHgMgBTwVgum%252b9sMESELw%3d%3d; Stock1: 25000
S1 = IT-2175: Tactile Switch, DPST; Thru-Hole; Vertical; Rating DC 12V, 50mA (max); Manufacturer: E-Switch; Descripción: Interruptores táctiles SPST SMD J-LEAD; CostoVendedor1: 0.43; Vendedor1: Mouser; Vendedor2: Digi-Key; DataSheet: https://www.e-switch.com/system/asset/product_line/data_sheet/158/TL3301.pdf; Package: J; PartNumber: TL3301AF160QJ; CostoVendedor2: 0.43; LinkVendedor1: https://ar.mouser.com/ProductDetail/E-Switch/TL3301AF160QJ?qs=%2fha2pyFadujx3gv2iG25gcw5Jio7UDqaqTkcH4vR60LrUmuJb9BKTQ%3d%3d; LinkVendedor2: https://www.digikey.com/product-detail/en/e-switch/TL3301AF160QJ/EG4374CT-ND/1144804; Stock1: 2800; Stock2: 44000
U2 = XC7A35T-1FTG256C: Artix-7 FPGA, 170 User I/Os, 0 GTP, 256-Ball BGA, Speed Grade 1, Commercial Grade, Pb-Free; Manufacturer: Xilinx Inc.; CostoVendedor2: 109; Vendedor1: Mouser; Vendedor2: Digi-Key; DataSheet: https://www.xilinx.com/support/documentation/data_sheets/ds181_Artix_7_Data_Sheet.pdf; Descripción: Artix-7 FPGA, 170 User I/Os, 0 GTP, 256-Ball BGA, Speed Grade 1, Commercial Grade, Pb-Free; LinkVendedor2: https://www.digikey.com/products/en?keywords=XC7A100T-1FTG256C; Package: 256-LBGA; PartNumber: XC7A100T-1FTG256C; Stock2: 214
Y2 = ASEM1-100.000MHZ-LC-T: Crystal; Manufacturer: SiTIME; Descripción: OSC MEMS 100.0000MHZ LVCMOS SMD; Tolerance: 20 PPM; CostoVendedor1: 1.23; Vendedor1: Mouser; Vendedor2: Digi-Key; DataSheet: https://media.digikey.com/pdf/Data%20Sheets/SiTime%20PDFs/SiT8008A.pdf; Package: 0.079" L x 0.063" W (2.00mm x 1.60mm); PartNumber: SIT8008AI-72-18E-100.000000G; Value: 100.000 MHz; LinkVendedor2: https://www.digikey.com/product-detail/en/sitime/SIT8008AI-72-18E-100.000000G/1473-30508-1-ND/7516960; Stock2: 250